# EAGLE design Philharmonic12 (EAGLE 7.7.0)
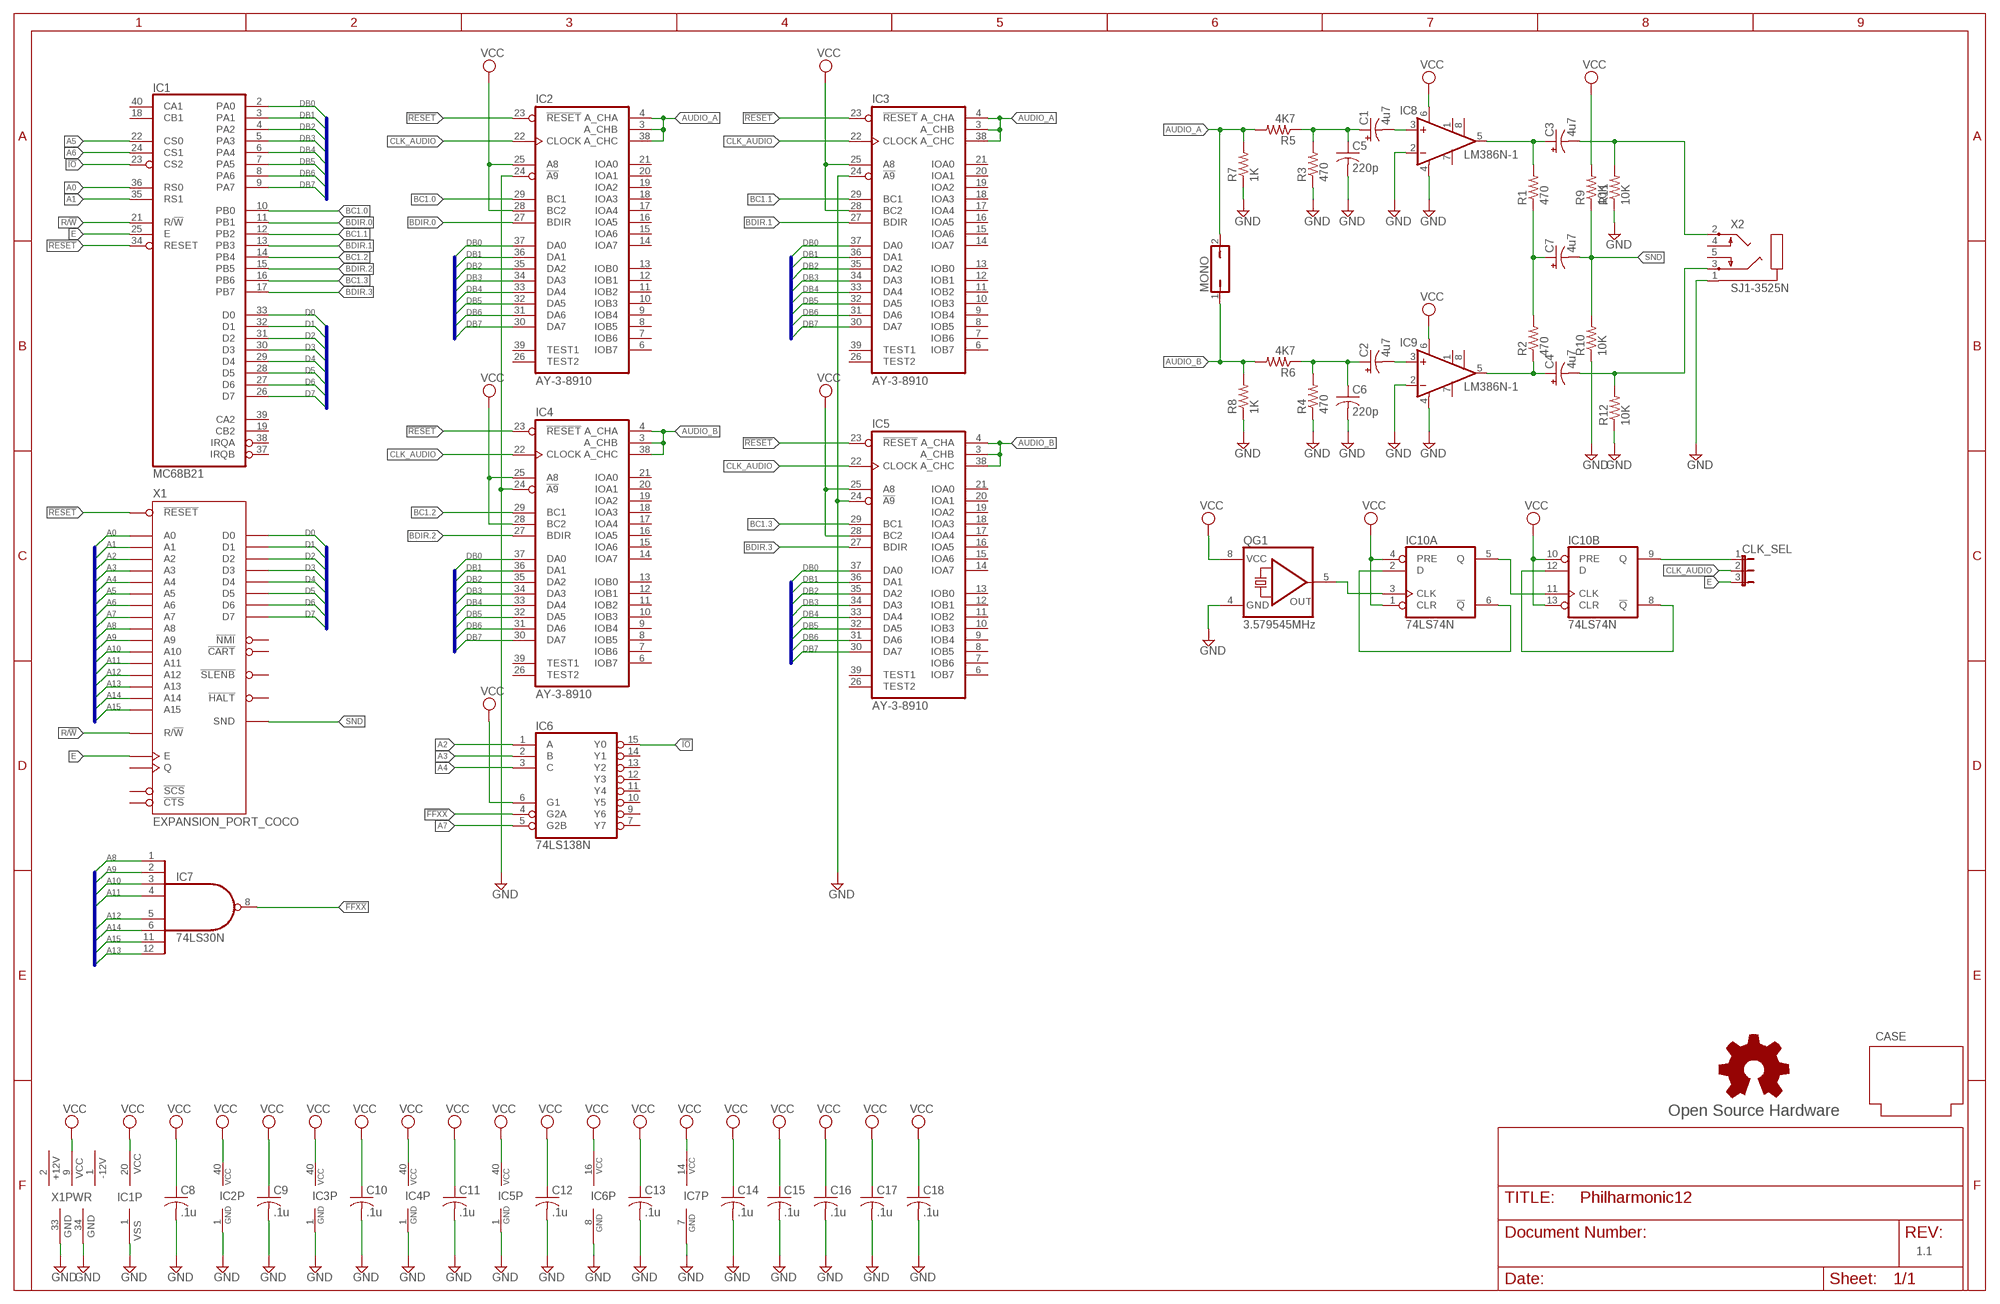
[diagram p0: schematic, sheet 1]

## Parts
C1  4u7  CPOL-USE2.5-6  [E2,5-6]
C2  4u7  CPOL-USE2.5-6  [E2,5-6]
C3  4u7  CPOL-USE2.5-6  [E2,5-6]
C4  4u7  CPOL-USE2.5-6  [E2,5-6]
C5  220p  C-US025-025X050  [C025-025X050]
C6  220p  C-US025-025X050  [C025-025X050]
C7  4u7  CPOL-USE2.5-6  [E2,5-6]
C8  .1u  C-US025-025X050  [C025-025X050]
C9  .1u  C-US025-025X050  [C025-025X050]
C10  .1u  C-US025-025X050  [C025-025X050]
C11  .1u  C-US025-025X050  [C025-025X050]
C12  .1u  C-US025-025X050  [C025-025X050]
C13  .1u  C-US025-025X050  [C025-025X050]
C14  .1u  C-US025-025X050  [C025-025X050]
C15  .1u  C-US025-025X050  [C025-025X050]
C16  .1u  C-US025-025X050  [C025-025X050]
C17  .1u  C-US025-025X050  [C025-025X050]
C18  .1u  C-US025-025X050  [C025-025X050]
CASE  PROGRAM_PAK  [PROGRAM_PAK]
CLK_SEL  JP2E  [JP2]
GOLD_ORB_SM1  Open Source Hardware  OSHWLOGOLOGO5MM  [OSHW_5MM]
IC1  MC68B21  6821R  [DIL40-ROUNDPAD]
IC2  AY-3-8910  AY-3-8910-RP  [DIL40-RP]
IC3  AY-3-8910  AY-3-8910-RP  [DIL40-RP]
IC4  AY-3-8910  AY-3-8910-RP  [DIL40-RP]
IC5  AY-3-8910  AY-3-8910-RP  [DIL40-RP]
IC6  74LS138N  [DIL16-RP]
IC7  74LS30N  74ALS30N  [DIL14-RP]
IC8  LM386N-1  [DIL08]
IC9  LM386N-1  [DIL08]
IC10  74LS74N  [DIL14-RP]
MONO  JP1Q  [JP1]
QG1  3.579545MHz  QG5460  [DIL08S]
R1  470  R-US_0204/7  [0204/7]
R2  470  R-US_0204/7  [0204/7]
R3  470  R-US_0204/7  [0204/7]
R4  470  R-US_0204/7  [0204/7]
R5  4K7  R-US_0204/7  [0204/7]
R6  4K7  R-US_0204/7  [0204/7]
R7  1K  R-US_0204/7  [0204/7]
R8  1K  R-US_0204/7  [0204/7]
R9  10K  R-US_0204/7  [0204/7]
R10  10K  R-US_0204/7  [0204/7]
R11  10K  R-US_0204/7  [0204/7]
R12  10K  R-US_0204/7  [0204/7]
X1  EXPANSION_PORT_COCO  [MA20-2]
X2  SJ1-3525N  [SJ1-3525N]

## Nets
!FFXX: IC6.4(G2A) IC7.8(O)
!IO: IC1.23(CS2) IC6.15(Y0)
!RESET: IC1.34(RESET) IC2.23(!RESET) IC3.23(!RESET) IC4.23(!RESET) IC5.23(!RESET) X1.5(!RESET)
A0: IC1.36(RS0) X1.19(A0)
A1: IC1.35(RS1) X1.20(A1)
A2: IC6.1(A) X1.21(A2)
A3: IC6.2(B) X1.22(A3)
A4: IC6.3(C) X1.23(A4)
A5: IC1.22(CS0) X1.24(A5)
A6: IC1.24(CS1) X1.25(A6)
A7: IC6.5(G2B) X1.26(A7)
A8: IC7.1(I0) X1.27(A8)
A9: IC7.2(I1) X1.28(A9)
A10: IC7.3(I2) X1.29(A10)
A11: IC7.4(I3) X1.30(A11)
A12: IC7.5(I4) X1.31(A12)
A13: IC7.12(I7) X1.37(A13)
A14: IC7.6(I5) X1.38(A14)
A15: IC7.11(I6) X1.39(A15)
AUDIO_A: IC2.3(A_CHB) IC2.4(A_CHA) IC2.38(A_CHC) IC3.3(A_CHB) IC3.4(A_CHA) IC3.38(A_CHC) MONO.2 R5.2 R7.2
AUDIO_B: IC4.3(A_CHB) IC4.4(A_CHA) IC4.38(A_CHC) IC5.3(A_CHB) IC5.4(A_CHA) IC5.38(A_CHC) MONO.1 R6.2 R8.2
BC1.0: IC1.10(PB0) IC2.29(BC1)
BC1.1: IC1.12(PB2) IC3.29(BC1)
BC1.2: IC1.14(PB4) IC4.29(BC1)
BC1.3: IC1.16(PB6) IC5.29(BC1)
BDIR.0: IC1.11(PB1) IC2.27(BDIR)
BDIR.1: IC1.13(PB3) IC3.27(BDIR)
BDIR.2: IC1.15(PB5) IC4.27(BDIR)
BDIR.3: IC1.17(PB7) IC5.27(BDIR)
CLK: IC10.3(A:CLK) QG1.5(OUT)
CLK/2: IC10.5(A:Q) IC10.11(B:CLK)
CLK/4: CLK_SEL.1 IC10.9(B:Q)
CLK_AUDIO: CLK_SEL.2 IC2.22(CLOCK) IC3.22(CLOCK) IC4.22(CLOCK) IC5.22(CLOCK)
D0: IC1.33(D0) X1.10(D0)
D1: IC1.32(D1) X1.11(D1)
D2: IC1.31(D2) X1.12(D2)
D3: IC1.30(D3) X1.13(D3)
D4: IC1.29(D4) X1.14(D4)
D5: IC1.28(D5) X1.15(D5)
D6: IC1.27(D6) X1.16(D6)
D7: IC1.26(D7) X1.17(D7)
DB0: IC1.2(PA0) IC2.37(DA0) IC3.37(DA0) IC4.37(DA0) IC5.37(DA0)
DB1: IC1.3(PA1) IC2.36(DA1) IC3.36(DA1) IC4.36(DA1) IC5.36(DA1)
DB2: IC1.4(PA2) IC2.35(DA2) IC3.35(DA2) IC4.35(DA2) IC5.35(DA2)
DB3: IC1.5(PA3) IC2.34(DA3) IC3.34(DA3) IC4.34(DA3) IC5.34(DA3)
DB4: IC1.6(PA4) IC2.33(DA4) IC3.33(DA4) IC4.33(DA4) IC5.33(DA4)
DB5: IC1.7(PA5) IC2.32(DA5) IC3.32(DA5) IC4.32(DA5) IC5.32(DA5)
DB6: IC1.8(PA6) IC2.31(DA6) IC3.31(DA6) IC4.31(DA6) IC5.31(DA6)
DB7: IC1.9(PA7) IC2.30(DA7) IC3.30(DA7) IC4.30(DA7) IC5.30(DA7)
E: CLK_SEL.3 IC1.25(E) X1.6(E)
GND: C5.2 C6.2 C8.2 C9.2 C10.2 C11.2 C12.2 C13.2 C14.2 C15.2 C16.2 C17.2 C18.2 IC1.1(VSS) IC2.1(GND) IC2.24(!A9) IC3.1(GND) IC3.24(!A9) IC4.1(GND) IC4.24(!A9) IC5.1(GND) IC5.24(!A9) IC6.8(GND) IC7.7(GND) IC8.2(-IN) IC8.4(GND) IC9.2(-IN) IC9.4(GND) QG1.4(GND) R3.1 R4.1 R7.1 R8.1 R10.1 R11.1 R12.1 X1.33(GND) X1.34(GND) X2.1
N$1: IC10.2(A:D) IC10.6(A:!Q)
N$3: C7.+ R1.1 R2.2
N$7: C4.- R12.2 X2.3
N$8: C3.+ IC8.5(OUT) R1.2
N$9: C4.+ IC9.5(OUT) R2.1
N$11: C1.- IC8.3(+IN)
N$12: C1.+ C5.1 R3.2 R5.1
N$13: C2.- IC9.3(+IN)
N$14: C2.+ C6.1 R4.2 R6.1
N$15: IC10.8(B:!Q) IC10.12(B:D)
N$16: C3.- R11.2 X2.2
R/!W: IC1.21(R/!W) X1.18(R/!W)
SND: C7.- R9.1 R10.2 X1.35(SND)
VCC: C8.1 C9.1 C10.1 C11.1 C12.1 C13.1 C14.1 C15.1 C16.1 C17.1 C18.1 IC1.20(VCC) IC2.25(A8) IC2.28(BC2) IC2.40(VCC) IC3.25(A8) IC3.28(BC2) IC3.40(VCC) IC4.25(A8) IC4.28(BC2) IC4.40(VCC) IC5.25(A8) IC5.28(BC2) IC5.40(VCC) IC6.6(G1) IC6.16(VCC) IC7.14(VCC) IC8.6(VS) IC9.6(VS) IC10.1(A:CLR) IC10.4(A:PRE) IC10.10(B:PRE) IC10.13(B:CLR) QG1.8(VCC) R9.2 X1.9(VCC)
Unconnected: IC1.18(CB1) IC1.19(CB2) IC1.37(IRQB) IC1.38(IRQA) IC1.39(CA2) IC1.40(CA1) IC2.6(IOB7) IC2.7(IOB6) IC2.8(IOB5) IC2.9(IOB4) IC2.10(IOB3) IC2.11(IOB2) IC2.12(IOB1) IC2.13(IOB0) IC2.14(IOA7) IC2.15(IOA6) IC2.16(IOA5) IC2.17(IOA4) IC2.18(IOA3) IC2.19(IOA2) IC2.20(IOA1) IC2.21(IOA0) IC2.26(TEST2) IC2.39(TEST1) IC3.6(IOB7) IC3.7(IOB6) IC3.8(IOB5) IC3.9(IOB4) IC3.10(IOB3) IC3.11(IOB2) IC3.12(IOB1) IC3.13(IOB0) IC3.14(IOA7) IC3.15(IOA6) IC3.16(IOA5) IC3.17(IOA4) IC3.18(IOA3) IC3.19(IOA2) IC3.20(IOA1) IC3.21(IOA0) IC3.26(TEST2) IC3.39(TEST1) IC4.6(IOB7) IC4.7(IOB6) IC4.8(IOB5) IC4.9(IOB4) IC4.10(IOB3) IC4.11(IOB2) IC4.12(IOB1) IC4.13(IOB0) IC4.14(IOA7) IC4.15(IOA6) IC4.16(IOA5) IC4.17(IOA4) IC4.18(IOA3) IC4.19(IOA2) IC4.20(IOA1) IC4.21(IOA0) IC4.26(TEST2) IC4.39(TEST1) IC5.6(IOB7) IC5.7(IOB6) IC5.8(IOB5) IC5.9(IOB4) IC5.10(IOB3) IC5.11(IOB2) IC5.12(IOB1) IC5.13(IOB0) IC5.14(IOA7) IC5.15(IOA6) IC5.16(IOA5) IC5.17(IOA4) IC5.18(IOA3) IC5.19(IOA2) IC5.20(IOA1) IC5.21(IOA0) IC5.26(TEST2) IC5.39(TEST1) IC6.7(Y7) IC6.9(Y6) IC6.10(Y5) IC6.11(Y4) IC6.12(Y3) IC6.13(Y2) IC6.14(Y1) IC8.1(GAIN) IC8.7(BYPASS) IC8.8(GAIN) IC9.1(GAIN) IC9.7(BYPASS) IC9.8(GAIN) X1.3(!HALT) X1.4(!NMI) X1.7(Q) X1.8(!CART) X1.32(!CTS) X1.36(!SCS) X1.40(!SLENB) X2.4 X2.5

## Buses
D[0..7]
DB[0..7]
A[0..15]

## Notes on the sheet
- 1.1

## Power pins joined to a net without a drawn wire
+12V: X1.2(+12V)
-12V: X1.1(-12V)
GND: IC10.7(P:GND)
VCC: IC10.14(P:VCC)

## Library data of the parts
C1-C4 C7 = rcl:CPOL-US: POLARIZED CAPACITOR, American symbol
C5 C6 C8-C18 = rcl:C-US: CAPACITOR, American symbol
CASE = coco:PROGRAM_PAK
CLK_SEL = jumper-jlb:JP2E: JUMPER
GOLD_ORB_SM1 = oshw:OSHWLOGO: The OSHW logo for PCB layout
IC1 = micro-motorola:6821: MICROCONTROLLER/MEMORY DEVICE
IC2-IC5 = general-instrument:AY-3-8910: Programmable sound generator
IC6 = 74xx-us-jlb:74*138: 3-line to 8-line DECODER/DEMULTIPLEXER
IC7 = 74xx-us-jlb:74*30: 8-input NAND gate
IC8 IC9 = linear:LM386?-*: Low Voltage Audio Power Amplifier Source: http://cache.national.com/ds/LM/LM386.pdf
IC10 = 74xx-us-jlb:74*74: Dual D type positive edge triggered FLIP FLOP, preset and clear
MONO = jumper-jlb:JP1Q: JUMPER
QG1 = crystal:QG5460: CRYSTAL RESONATOR; OC_FARNELL: unknown; OC_NEWARK: unknown
R1-R12 = rcl:R-US_: RESISTOR, American symbol
X1 = coco:EXPANSION_PORT_COCO
X2 = con-cui-jb:SJ1-3525N

## Board
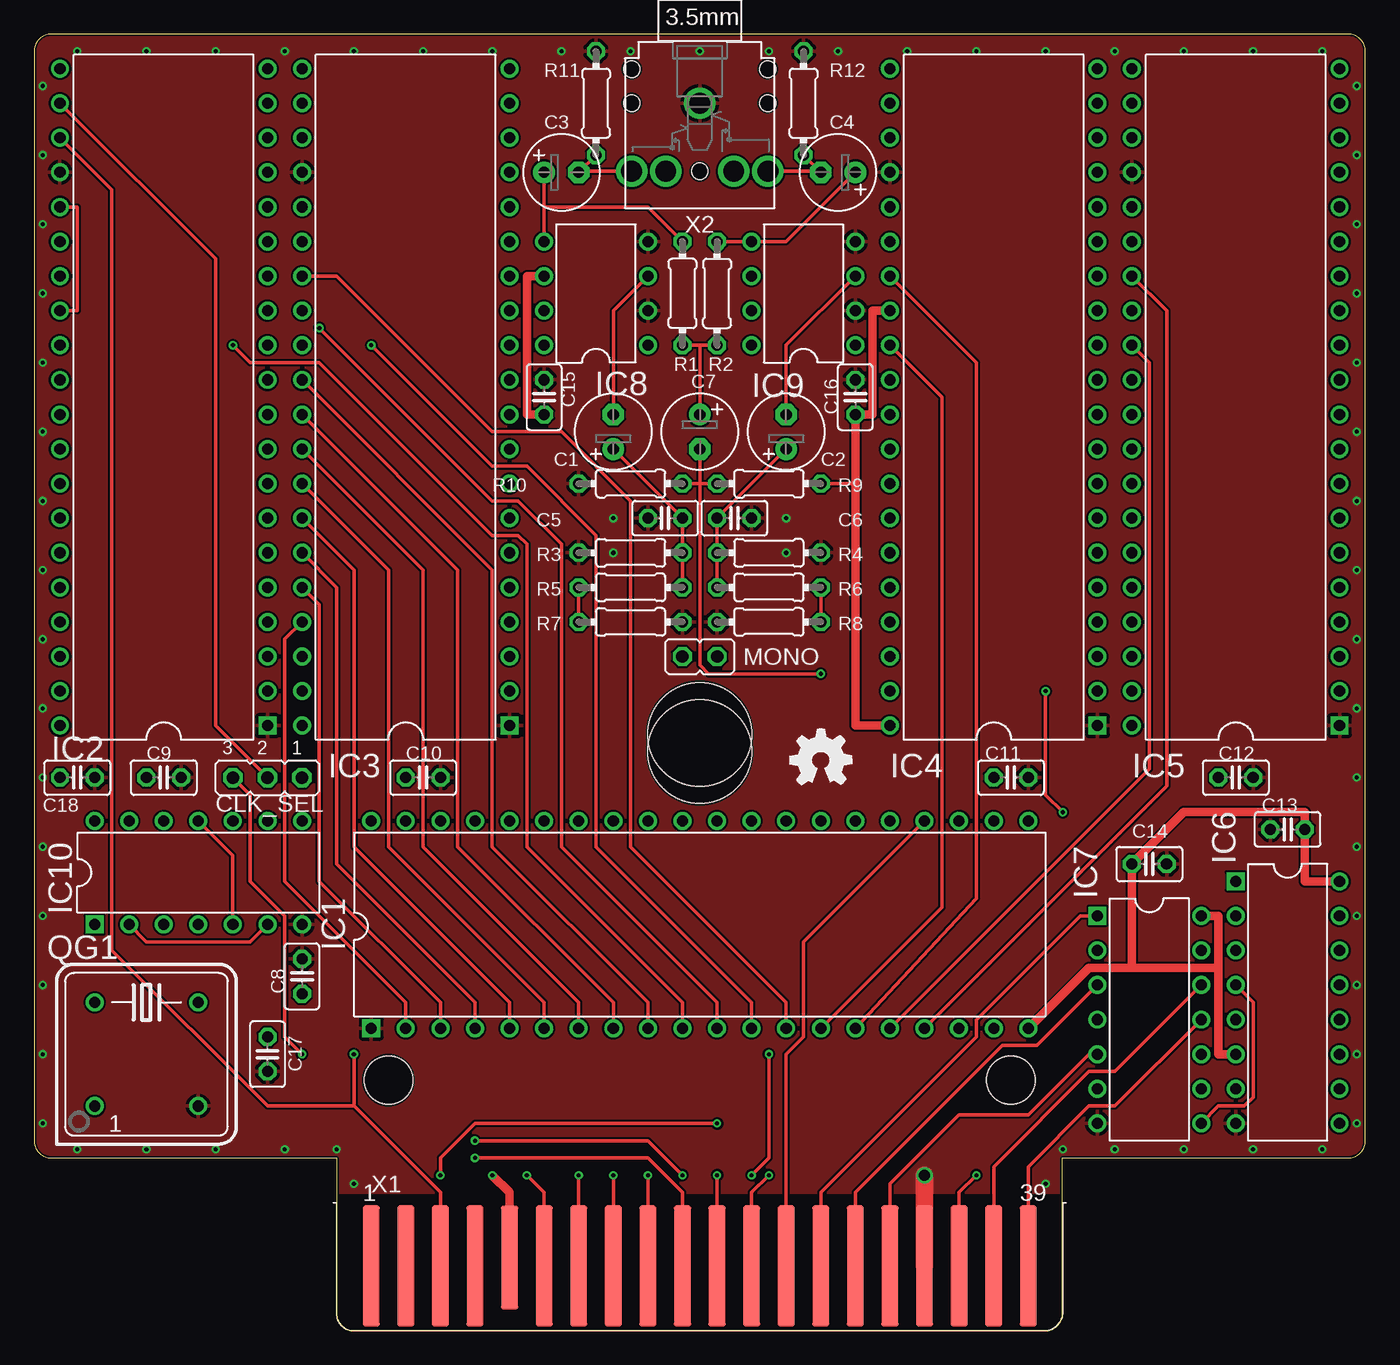
[diagram p1: board, top side]
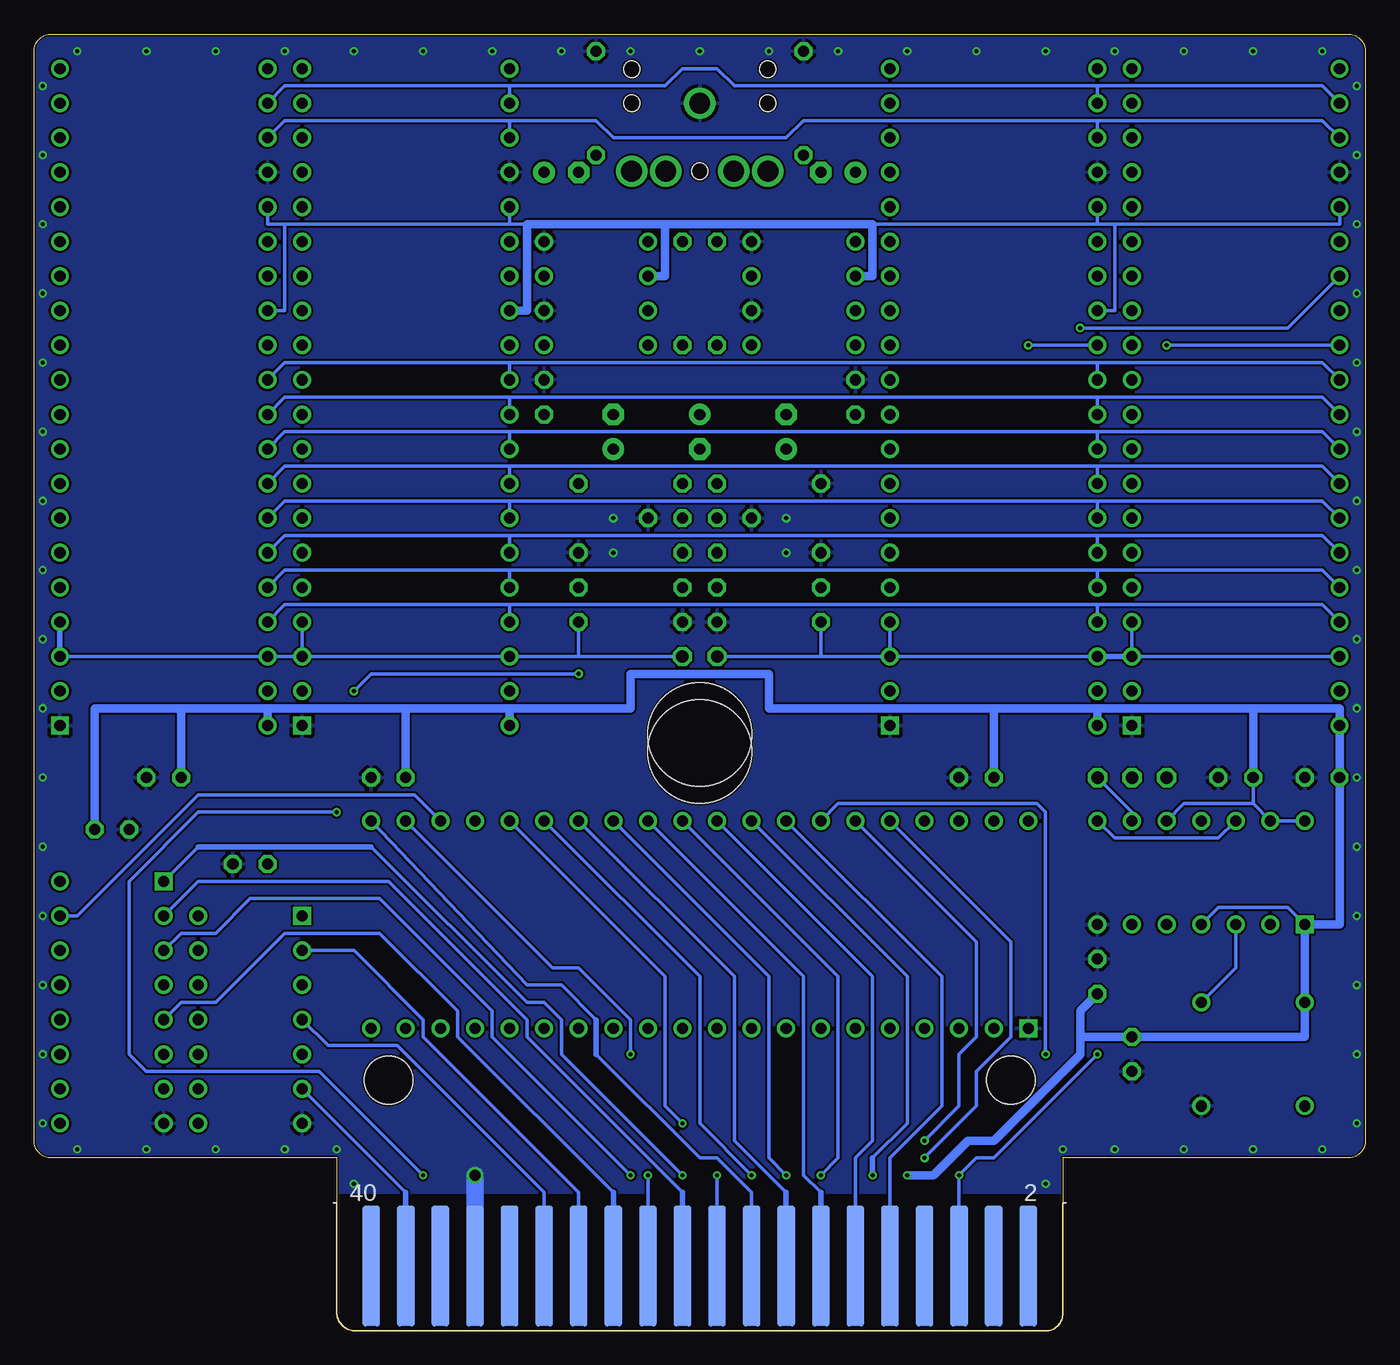
[diagram p2: board, bottom side, seen from below]

Size 97.79 x 95.25 mm. Coordinates in mm from the lower left corner, seen from the top.
Outline: 22.23,12.7 22.23,1.27 arc90 23.5,0 74.28,0 arc90 75.55,1.27 75.55,12.7 96.52,12.7 arc90 97.79,13.97 97.79,93.98 arc90 96.52,95.25 1.27,95.25 arc90 0,93.98 0,13.97 arc90 1.27,12.7 22.23,12.7
Copper layers (1*16): Top 0.035mm / dielectric 1.5mm / Bottom 0.035mm
Design rules "hackvana": minimum track width 6mil, minimum drill 0.3mm, track to track 6mil, track to pad 6mil, pad to pad 6mil, via to via 6mil, smd to smd 0mil, copper to edge 6mil, drill to drill 6mil, minimum pad ring 10mil, minimum via ring 6mil, stop-mask expansion 2mil, vias tented up to drill 100mil, thermal gap 10mil

### Footprints (pad centres in the part's own frame; a part is rotated, then mirrored left to right if it is on the bottom)
E2,5-6 = drill 0.813 pad 1.6: + -1.27,0 | drill 0.813 pad 1.6 octagon: - 1.27,0
C025-025X050 = drill 0.813 octagon: 1 -1.27,0; 2 1.27,0
PROGRAM_PAK = hole 7.62: 0,1.27; 0,0 | hole 3.556: -22.86,-24.13; 22.86,-24.13
JP2 = drill 0.914 octagon: 1 -2.54,0; 2 0,0; 3 2.54,0
DIL40-ROUNDPAD = drill 0.813 square: 1 -24.13,-7.62 | drill 0.813: 2 -21.59,-7.62; 3 -19.05,-7.62; 4 -16.51,-7.62; 5 -13.97,-7.62; 6 -11.43,-7.62; 7 -8.89,-7.62; 8 -6.35,-7.62; 9 -3.81,-7.62; 10 -1.27,-7.62; 11 1.27,-7.62; 12 3.81,-7.62; 13 6.35,-7.62; 14 8.89,-7.62; 15 11.43,-7.62; 16 13.97,-7.62; 17 16.51,-7.62; 18 19.05,-7.62; 19 21.59,-7.62; 20 24.13,-7.62; 21 24.13,7.62; 22 21.59,7.62; 23 19.05,7.62; 24 16.51,7.62; 25 13.97,7.62; 26 11.43,7.62; 27 8.89,7.62; 28 6.35,7.62; 29 3.81,7.62; 30 1.27,7.62; 31 -1.27,7.62; 32 -3.81,7.62; 33 -6.35,7.62; 34 -8.89,7.62; 35 -11.43,7.62; 36 -13.97,7.62; 37 -16.51,7.62; 38 -19.05,7.62; 39 -21.59,7.62; 40 -24.13,7.62
DIL40-RP = drill 0.813 square: 1 -24.13,-7.62 | drill 0.813: 2 -21.59,-7.62; 3 -19.05,-7.62; 4 -16.51,-7.62; 5 -13.97,-7.62; 6 -11.43,-7.62; 7 -8.89,-7.62; 8 -6.35,-7.62; 9 -3.81,-7.62; 10 -1.27,-7.62; 11 1.27,-7.62; 12 3.81,-7.62; 13 6.35,-7.62; 14 8.89,-7.62; 15 11.43,-7.62; 16 13.97,-7.62; 17 16.51,-7.62; 18 19.05,-7.62; 19 21.59,-7.62; 20 24.13,-7.62; 21 24.13,7.62; 22 21.59,7.62; 23 19.05,7.62; 24 16.51,7.62; 25 13.97,7.62; 26 11.43,7.62; 27 8.89,7.62; 28 6.35,7.62; 29 3.81,7.62; 30 1.27,7.62; 31 -1.27,7.62; 32 -3.81,7.62; 33 -6.35,7.62; 34 -8.89,7.62; 35 -11.43,7.62; 36 -13.97,7.62; 37 -16.51,7.62; 38 -19.05,7.62; 39 -21.59,7.62; 40 -24.13,7.62
DIL16-RP = drill 0.813 square: 1 -8.89,-3.81 | drill 0.813: 2 -6.35,-3.81; 3 -3.81,-3.81; 4 -1.27,-3.81; 5 1.27,-3.81; 6 3.81,-3.81; 7 6.35,-3.81; 8 8.89,-3.81; 9 8.89,3.81; 10 6.35,3.81; 11 3.81,3.81; 12 1.27,3.81; 13 -1.27,3.81; 14 -3.81,3.81; 15 -6.35,3.81; 16 -8.89,3.81
DIL14-RP = drill 0.813 square: 1 -7.62,-3.81 | drill 0.813: 2 -5.08,-3.81; 3 -2.54,-3.81; 4 0,-3.81; 5 2.54,-3.81; 6 5.08,-3.81; 7 7.62,-3.81; 8 7.62,3.81; 9 5.08,3.81; 10 2.54,3.81; 11 0,3.81; 12 -2.54,3.81; 13 -5.08,3.81; 14 -7.62,3.81
DIL08 = drill 0.813 pad 1.27: 1 -3.81,-3.81; 2 -1.27,-3.81; 3 1.27,-3.81; 4 3.81,-3.81; 5 3.81,3.81; 6 1.27,3.81; 7 -1.27,3.81; 8 -3.81,3.81
JP1 = drill 0.914 octagon: 1 0,-1.27; 2 0,1.27
DIL08S = drill 0.813: 1 -3.81,-3.81; 4 3.81,-3.81; 5 3.81,3.81; 8 -3.81,3.81
0204/7 = drill 0.813 octagon: 1 -3.81,0; 2 3.81,0
MA20-2 = smd 1.27 x 8.89: 1 -24.13,-0.305; 3 -21.59,-0.305; 5 -19.05,-0.305; 7 -16.51,-0.305; 11 -11.43,-0.305; 13 -8.89,-0.305; 15 -6.35,-0.305; 17 -3.81,-0.305; 19 -1.27,-0.305; 21 1.27,-0.305; 23 3.81,-0.305; 25 6.35,-0.305; 27 8.89,-0.305; 29 11.43,-0.305; 31 13.97,-0.305; 33 16.51,-0.305; 35 19.05,-0.305; 37 21.59,-0.305; 39 24.13,-0.305 | smd 1.27 x 8.89 bottom: 2 -24.13,-0.305; 4 -21.59,-0.305; 6 -19.05,-0.305; 8 -16.51,-0.305; 10 -13.97,-0.305; 12 -11.43,-0.305; 14 -8.89,-0.305; 16 -6.35,-0.305; 18 -3.81,-0.305; 20 -1.27,-0.305; 22 1.27,-0.305; 24 3.81,-0.305; 26 6.35,-0.305; 28 8.89,-0.305; 30 11.43,-0.305; 32 13.97,-0.305; 34 16.51,-0.305; 36 19.05,-0.305; 38 21.59,-0.305; 40 24.13,-0.305 | smd 1.27 x 7.62: 9 -13.97,0.305
SJ1-3525N = drill 1.53: 1 0,0; 2 5,-5; 3 5,5; 4 5,-2.5; 5 5,2.5 | hole 1.2: 0,5; -2.5,5; 5,0; 0,-5; -2.5,-5

### Placement (x,y rotation side)
C1  42.55,66.04 90 top
C2  55.25,66.04 90 top
C3  38.73,85.09 0 top
C4  59.06,85.09 180 top
C5  46.36,59.69 180 top
C6  51.44,59.69 0 top
C7  48.9,66.04 270 top
C8  19.69,26.04 90 top
C9  9.53,40.64 0 top
C10  28.58,40.64 0 top
C11  71.75,40.64 0 top
C12  88.27,40.64 0 top
C13  92.08,36.83 180 top
C14  81.92,34.29 0 top
C15  37.47,68.58 90 top
C16  60.33,68.58 90 top
C17  17.15,20.32 270 top
C18  3.18,40.64 0 top
CASE  48.9,42.55 0 top
CLK_SEL  17.15,40.64 180 top
GOLD_ORB_SM1  57.79,41.91 0 top
IC1  48.9,29.84 0 top
IC2  9.53,68.58 90 top
IC3  27.31,68.58 90 top
IC4  70.48,68.58 90 top
IC5  88.27,68.58 90 top
IC6  92.08,24.13 270 top
IC7  81.92,22.86 270 top
IC8  41.28,76.2 90 top
IC9  56.52,76.2 90 top
IC10  12.07,33.66 0 top
MONO  48.9,49.53 90 top
QG1  8.26,20.32 0 top
R1  47.62,76.2 90 top
R2  50.17,76.2 270 top
R3  43.82,57.15 0 top
R4  53.98,57.15 180 top
R5  43.82,54.61 180 top
R6  53.98,54.61 0 top
R7  43.82,52.07 180 top
R8  53.98,52.07 0 top
R9  53.98,62.23 0 top
R10  43.82,62.23 0 top
R11  41.28,90.17 270 top
R12  56.52,90.17 270 top
X1  48.9,5.08 0 top
X2  48.9,90.17 270 top

### Tracks (layer width: path | path; a pad name or v marks a point on that pad's centre or on a via)
!FFXX
  Top 0.254: IC6.4 89.53,24.13 89.53,17.14 88.9,16.51 87,16.51 IC7.8
!IO
  Bottom 0.254: IC1.23 69.85,39.37 85.72,39.37 94.62,30.48 IC6.15
!RESET  (via drill 0.3)
  Top 0.254: X1.5 29.85,10.16 23.5,16.51 | IC2.23 5.72,83.82 5.72,27.94 17.15,16.51 23.5,16.51 | 23.5,16.51 v23.5,20.32
  Bottom 0.254: IC2.23 3.18,88.9 19.69,88.9 | IC3.23 19.69,88.9 | 19.69,88.9 41.28,88.9 42.55,87.63 55.25,87.63 56.52,88.9 62.87,88.9 | IC5.23 79.38,88.9 62.87,88.9 | 62.87,88.9 IC4.23 | IC1.34 38.73,38.73 24.13,38.73 23.5,38.1 v23.5,20.32
A0  (via drill 0.3)
  Top 0.254: X1.19 47.62,10.16 45.09,12.7 v32.39,12.7
  Bottom 0.254: v32.39,12.7 28.58,16.51 28.58,19.05 26.04,21.59 26.04,28.57 IC1.36
A1  (via drill 0.3)
  Top 0.254: v47.62,11.43 45.09,13.97 v32.39,13.97
  Bottom 0.254: X1.20 v47.62,11.43 | v32.39,13.97 29.85,16.51 29.85,20.32 28.58,21.59 28.58,28.57 IC1.35
A2  (via drill 0.3)
  Top 0.254: X1.21 v50.17,11.43
  Bottom 0.254: v50.17,11.43 59.06,20.32 59.06,22.86 60.33,24.13 61.59,24.13 73.03,35.56 | 85.72,35.56 IC6.1
  Bottom 0.406: 73.03,35.56 85.72,35.56
A3
  Bottom 0.254: 50.17,10.16 61.59,21.59 61.59,22.86 71.75,33.02 85.72,33.02 IC6.2
  Bottom 0.406: X1.22 50.17,10.16
A4  (via drill 0.3)
  Top 0.254: X1.23 52.71,10.16 v53.98,11.43
  Bottom 0.254: v53.98,11.43 64.14,21.59 64.14,23.5 72.39,31.75 81.92,31.75 84.46,29.21 87,29.21 IC6.3
A5  (via drill 0.3)
  Top 0.254: v52.71,11.43 53.98,12.7 v53.98,20.32
  Bottom 0.254: X1.24 v52.71,11.43 | v53.98,20.32 53.98,22.86 57.79,26.67 59.69,26.67 IC1.22
A6
  Top 0.254: X1.25 55.25,20.32 56.52,21.59 56.52,28.57 IC1.24
A7
  Bottom 0.254: 55.25,10.16 66.68,21.59 66.68,23.5 72.39,29.21 79.38,29.21 84.46,24.13 87,24.13 IC6.5
  Bottom 0.406: X1.26 55.25,10.16
A8
  Top 0.254: X1.27 57.79,10.16 69.22,21.59 69.22,22.86 76.84,30.48 IC7.1
A9
  Bottom 0.254: X1.28 57.79,10.16 69.22,21.59 69.22,22.86 74.3,27.94 IC7.2
A10
  Top 0.254: X1.29 60.33,10.16 71.12,20.95 73.66,20.95 IC7.3
A11
  Bottom 0.254: X1.30 60.33,10.16 71.12,20.95 76.2,20.95 IC7.4
A12
  Top 0.254: X1.31 62.87,10.79 67.95,15.88 73.03,15.88 77.47,20.32 IC7.5
A13
  Top 0.254: X1.37 70.48,12.06 77.47,19.05 79.38,19.05 IC7.12
A14
  Bottom 0.254: 70.48,10.16 IC7.6
  Bottom 0.406: X1.38 70.48,10.16
A15
  Top 0.254: X1.39 73.03,12.06 77.47,16.51 79.38,16.51 IC7.11
AUDIO_A
  Top 0.254: R7.2 R5.2
  Bottom 0.254: IC3.4 IC3.3 | IC2.4 IC2.3 IC2.38 | IC3.3 IC3.38 | MONO.2 40.01,49.53 | 40.01,49.53 IC3.3 | R7.2 40.01,49.53
  Bottom 0.406: IC3.38 IC2.3
AUDIO_B
  Top 0.254: R8.2 R6.2
  Bottom 0.254: IC4.3 IC4.38 57.79,49.53 | IC4.3 IC4.4 | IC4.3 IC5.38 IC5.3 | 57.79,49.53 MONO.1 | R8.2 57.79,49.53
  Bottom 0.406: IC5.3 IC5.4
BC1.0  (via drill 0.3)
  Top 0.254: IC1.10 47.62,24.13 36.2,35.56 36.2,57.78 35.56,58.42 33.66,58.42 20.96,71.12 15.88,71.12 v14.61,72.39
  Bottom 0.254: v14.61,72.39 IC2.29
BC1.1  (via drill 0.3)
  Top 0.254: IC1.12 52.71,24.13 41.28,35.56 41.28,58.42 36.2,63.5 33.66,63.5 v24.77,72.39
  Bottom 0.254: v24.77,72.39 IC3.29
BC1.2
  Top 0.254: IC1.14 66.68,31.11 66.68,68.58 IC4.29
BC1.3
  Top 0.254: IC1.16 81.92,41.27 81.92,71.12 IC5.29
BDIR.0  (via drill 0.3)
  Top 0.254: IC1.11 50.17,24.13 38.73,35.56 38.73,57.78 35.56,60.96 33.66,60.96 v20.96,73.66
  Bottom 0.254: v20.96,73.66 5.72,73.66 IC2.27
BDIR.1
  Top 0.254: IC1.13 55.25,24.13 43.82,35.56 43.82,60.96 38.73,66.04 33.66,66.04 22.23,77.47 IC3.27
BDIR.2
  Top 0.254: IC1.15 69.22,31.75 69.22,71.12 IC4.27
BDIR.3
  Top 0.254: IC1.17 83.19,40.01 83.19,74.93 IC5.27
CLK
  Bottom 0.254: QG1.5 9.53,26.67 IC10.3
CLK/2
  Top 0.254: IC10.11 14.61,34.92 IC10.5
CLK/4
  Bottom 0.254: CLK_SEL.1 17.15,38.1 IC10.9
CLK_AUDIO
  Top 0.254: IC2.22 13.34,78.74 13.34,44.45 CLK_SEL.2
  Bottom 0.254: IC2.22 3.18,91.44 19.69,91.44 | 19.69,91.44 46.36,91.44 47.62,92.71 50.17,92.71 51.44,91.44 62.87,91.44 | 62.87,91.44 79.38,91.44 IC5.22 | IC4.22 62.87,91.44 | IC3.22 19.69,91.44
D0
  Bottom 0.254: X1.10 34.93,12.7 31.12,16.51 31.12,26.04 IC1.33
D1  (via drill 0.3)
  Top 0.254: X1.11 37.47,10.16 v36.2,11.43
  Bottom 0.254: 36.2,12.7 33.66,15.24 33.66,26.04 IC1.32
  Bottom 0.406: v36.2,11.43 36.2,12.7
D2
  Bottom 0.254: X1.12 37.47,12.7 36.2,13.97 36.2,26.04 IC1.31
D3  (via drill 0.3)
  Top 0.254: X1.13 v40.01,11.43
  Bottom 0.254: v40.01,11.43 38.73,12.7 38.73,26.04 IC1.30
D4
  Bottom 0.254: 40.01,10.16 41.28,11.43 41.28,26.04 IC1.29
  Bottom 0.406: X1.14 40.01,10.16
D5  (via drill 0.3)
  Top 0.254: X1.15 v42.55,11.43
  Bottom 0.254: v42.55,11.43 43.82,12.7 43.82,26.04 IC1.28
D6
  Bottom 0.254: 42.55,10.16 46.36,13.97 46.36,26.04 IC1.27
  Bottom 0.406: X1.16 42.55,10.16
D7  (via drill 0.3)
  Top 0.254: X1.17 v45.09,11.43
  Bottom 0.254: v45.09,11.43 48.9,15.24 48.9,26.04 IC1.26
DB0
  Top 0.254: IC1.2 27.31,24.13 18.42,33.02 18.42,50.8 IC3.37
  Bottom 0.254: IC2.37 3.18,53.34 19.69,53.34 | 19.69,53.34 62.87,53.34 | 62.87,53.34 79.38,53.34 IC5.37 | IC3.37 19.69,53.34 | IC4.37 62.87,53.34
DB1
  Top 0.254: IC1.3 29.85,24.13 20.96,33.02 20.96,53.34 IC3.36
  Bottom 0.254: IC2.36 3.18,55.88 19.69,55.88 | 19.69,55.88 62.87,55.88 | 62.87,55.88 79.38,55.88 IC5.36 | IC3.36 19.69,55.88 | IC4.36 62.87,55.88
DB2
  Top 0.254: IC1.4 32.39,24.13 22.23,34.29 22.23,54.61 IC3.35
  Bottom 0.254: IC2.35 3.18,58.42 19.69,58.42 | 19.69,58.42 62.87,58.42 | 62.87,58.42 79.38,58.42 IC5.35 | IC3.35 19.69,58.42 | IC4.35 62.87,58.42
DB3
  Top 0.254: IC1.5 34.93,24.13 23.5,35.56 23.5,55.88 IC3.34
  Bottom 0.254: IC2.34 3.18,60.96 19.69,60.96 | 19.69,60.96 62.87,60.96 | 62.87,60.96 79.38,60.96 IC5.34 | IC3.34 19.69,60.96 | IC4.34 62.87,60.96
DB4
  Top 0.254: IC1.6 37.47,24.13 26.04,35.56 26.04,55.88 IC3.33
  Bottom 0.254: IC2.33 3.18,63.5 19.69,63.5 | 19.69,63.5 62.87,63.5 | 62.87,63.5 79.38,63.5 IC5.33 | IC3.33 19.69,63.5 | IC4.33 62.87,63.5
DB5
  Top 0.254: IC1.7 40.01,24.13 28.58,35.56 28.58,55.88 IC3.32
  Bottom 0.254: IC2.32 3.18,66.04 19.69,66.04 | 19.69,66.04 62.87,66.04 | 62.87,66.04 79.38,66.04 IC5.32 | IC3.32 19.69,66.04 | IC4.32 62.87,66.04
DB6
  Top 0.254: IC1.8 42.55,24.13 31.12,35.56 31.12,55.88 IC3.31
  Bottom 0.254: IC2.31 3.18,68.58 19.69,68.58 | 19.69,68.58 62.87,68.58 | 62.87,68.58 79.38,68.58 IC5.31 | IC3.31 19.69,68.58 | IC4.31 62.87,68.58
DB7
  Top 0.254: IC1.9 45.09,24.13 33.66,35.56 33.66,55.88 IC3.30
  Bottom 0.254: IC2.30 3.18,71.12 19.69,71.12 | 19.69,71.12 62.87,71.12 | 62.87,71.12 79.38,71.12 IC5.30 | IC4.30 62.87,71.12 | IC3.30 19.69,71.12
E  (via drill 0.3)
  Top 0.254: v29.85,11.43 29.85,12.7 32.39,15.24 v50.17,15.24 | CLK_SEL.3 15.88,39.37 15.88,33.02 18.42,30.48 18.42,21.59 v19.69,20.32
  Bottom 0.254: X1.6 v29.85,11.43 28.58,12.7 27.31,12.7 v19.69,20.32 | v50.17,15.24 51.44,16.51 51.44,26.04 IC1.25
GND  (via drill 0.3, 0.8)
  Top 1.27: v65.41,11.43 X1.33
  Bottom 1.27: X1.33 v65.41,11.43
  other vias: 42.55,59.69 42.55,57.15 55.25,59.69 55.25,57.15 0.64,15.24 0.64,20.32 0.64,25.4 0.64,30.48 0.64,35.56 0.64,40.64 0.64,45.72 22.23,13.34 18.42,13.34 13.34,13.34 8.26,13.34 3.18,13.34 94.62,13.34 89.53,13.34 84.46,13.34 79.38,13.34 75.56,13.34 74.3,10.79 23.5,10.79 97.16,15.24 97.16,20.32 97.16,25.4 97.16,30.48 97.16,35.56 97.16,40.64 97.16,45.72 97.16,50.8 97.16,55.88 97.16,60.96 97.16,66.04 97.16,71.12 97.16,76.2 97.16,81.28 97.16,86.36 97.16,91.44 94.62,93.98 89.53,93.98 84.46,93.98 79.38,93.98 74.3,93.98 69.22,93.98 64.14,93.98 59.06,93.98 53.98,93.98 48.9,93.98 43.82,93.98 38.73,93.98 33.66,93.98 28.58,93.98 23.5,93.98 18.42,93.98 13.34,93.98 8.26,93.98 3.18,93.98 0.64,86.36 0.64,91.44 0.64,50.8 0.64,55.88 0.64,60.96 0.64,66.04 0.64,71.12 0.64,76.2 0.64,81.28
  pour Top: 22.23,12.7 1.27,12.7 arc-90 0,13.97 0,93.98 arc-90 1.27,95.25 96.52,95.25 arc-90 97.79,93.98 97.79,13.97 arc-90 96.52,12.7 75.56,12.7 75.56,10.16 22.23,10.16
  pour Bottom: 22.23,12.7 1.27,12.7 arc-90 0,13.97 0,93.98 arc-90 1.27,95.25 96.52,95.25 arc-90 97.79,93.98 97.79,13.97 arc-90 96.52,12.7 75.56,12.7 75.56,10.16 22.23,10.16
N$1
  Top 0.254: IC10.6 15.88,28.57 8.26,28.57 IC10.2
N$3
  Top 0.254: R1.1 48.9,72.39 | 48.9,72.39 R2.2 | C7.+ 48.9,72.39
N$7
  Top 0.254: R12.2 C4.- 57.71,85.17 X2.3
N$8
  Top 0.254: IC8.5 37.47,82.55 | 37.47,82.55 C3.+ | R1.2 45.09,82.55 37.47,82.55
N$9
  Top 0.254: R2.1 IC9.5 55.25,80.01 C4.+
N$11
  Top 0.254: C1.- 42.55,74.93 IC8.3
N$12
  Top 0.254: R5.1 R3.2 C5.1 C1.+
N$13
  Top 0.254: C2.- 55.25,72.39 IC9.3
N$14
  Top 0.254: R6.1 R4.2 C6.1 C2.+
N$15
  Bottom 0.254: IC10.12 10.8,36.2 18.42,36.2 IC10.8
N$16
  Top 0.254: R11.2 C3.- 40.09,85.17 X2.2
R/!W
  Bottom 0.254: X1.18 45.09,10.16 47.62,12.7 48.9,12.7 56.52,20.32 | 56.52,22.86 59.06,25.4 61.59,25.4 IC1.21
  Bottom 0.406: 56.52,20.32 56.52,22.86
SND  (via drill 0.3)
  Top 0.254: R10.2 48.9,62.23 | C7.- 48.9,62.23 | X1.35 67.95,10.16 v69.22,11.43 | R9.1 48.9,62.23 | 48.9,62.23 48.9,48.9 49.53,48.26 v57.79,48.26 | v74.3,46.99 74.3,39.37 v75.56,38.1
  Bottom 0.254: v69.22,11.43 76.84,19.05 89.53,19.05 90.81,20.32 90.81,33.02 85.72,38.1 78.74,38.1 v75.56,38.1 | v57.79,48.26 73.03,48.26 v74.3,46.99
VCC  (via drill 0.3)
  Top 0.254: IC2.28 3.18,74.93 3.18,82.55 IC2.25 | R9.2 60.33,62.23
  Top 0.61: X1.9 34.93,10.16 v33.66,11.43 | IC1.20 77.47,26.67 80.65,26.67 | IC6.6 87,20.32 87,26.67 | 87,26.67 87,30.48 IC7.14 | 80.65,26.67 C14.1 84.46,38.1 93.34,38.1 C13.1 93.34,33.02 IC6.16 | 80.65,26.67 87,26.67 | IC8.6 36.2,77.47 36.2,67.31 C15.1 | IC4.40 60.33,44.45 60.33,62.23 C16.1 61.59,67.31 61.59,74.93 IC4.28
  Bottom 0.254: IC2.25 1.91,81.28 18.42,81.28 | 18.42,81.28 19.69,81.28 | 19.69,81.28 IC3.25 | 62.87,81.28 61.59,81.28 | 36.2,81.28 19.69,81.28 | IC4.25 62.87,81.28 | 62.87,81.28 79.38,81.28 | 79.38,81.28 80.65,81.28 IC5.25 | IC3.28 18.42,74.93 18.42,81.28 | IC5.28 79.38,74.93 79.38,81.28 | IC10.14 IC10.13 8.26,38.73 | IC10.10 13.34,38.73 8.26,38.73 | C9.1 8.26,38.73 | IC10.4 10.8,31.11 5.72,31.11 IC10.1
  Bottom 0.61: v33.66,11.43 31.75,11.43 29.21,13.97 27.31,13.97 20.96,20.32 20.96,21.59 | C8.1 20.96,23.5 20.96,21.59 | IC5.40 80.65,45.72 | 80.65,45.72 87,45.72 | 87,45.72 C12.1 | C11.1 70.48,45.72 | 70.48,45.72 80.65,45.72 | IC4.40 62.87,45.72 | 62.87,45.72 70.48,45.72 | C10.1 27.31,45.72 | 27.31,45.72 43.82,45.72 43.82,48.26 53.98,48.26 53.98,45.72 62.87,45.72 | IC3.40 19.69,45.72 | 19.69,45.72 27.31,45.72 | 8.26,45.72 1.91,45.72 IC2.40 C18.1 1.91,29.84 IC10.1 QG1.8 4.45,21.59 C17.1 20.96,21.59 | 8.26,45.72 19.69,45.72 | C13.1 93.34,45.72 87,45.72 | 51.44,81.28 61.59,81.28 61.59,74.93 IC4.28 | 51.44,81.28 36.2,81.28 36.2,77.47 IC8.6 | IC9.6 51.44,77.47 51.44,81.28 | C9.1 8.26,45.72

### Text on the board
tDocu: Philharmonic 12 v1.1 / PCB (c) 2018 RETRO Innovations / www.go4retro.com / CC-BY-SA 4.0